# Altium project PCB_3U_CLK_Dist.PrjPcb
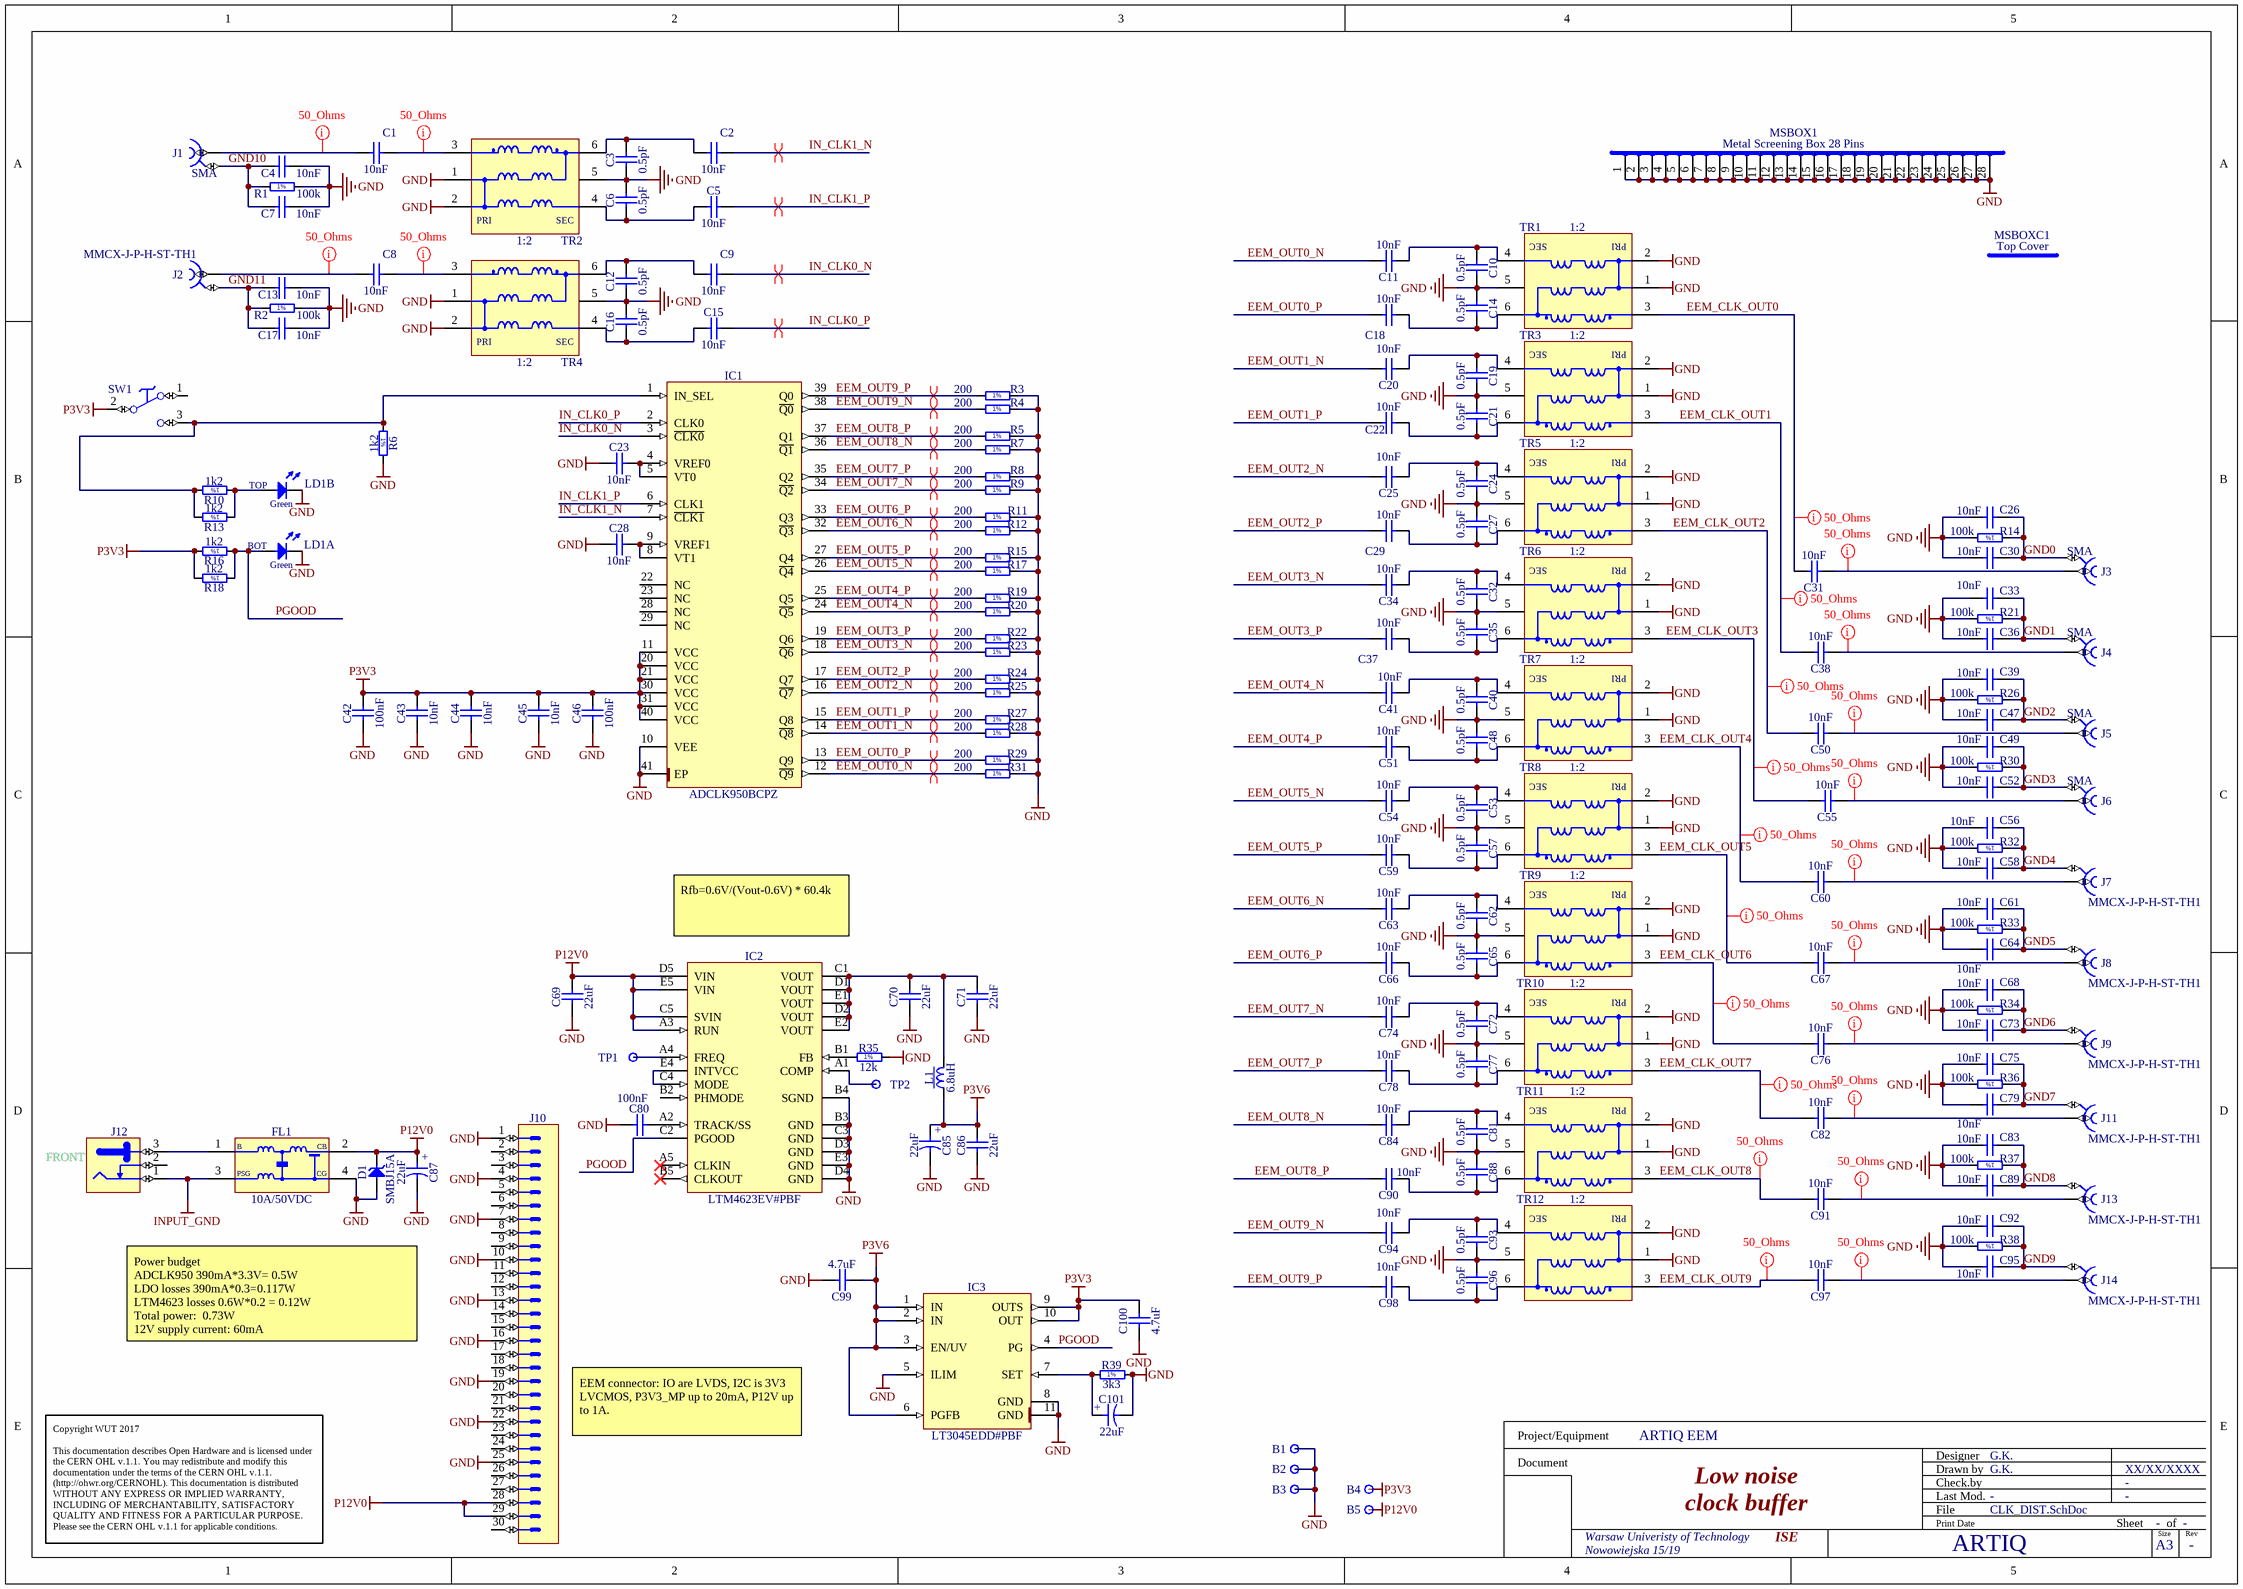
[diagram p0: CLK_DIST.SchDoc]
1 sheet, 183 parts. Net scope: global (net labels, ports and power ports of the same name join across sheets).
Board file: PCB_3U_CLK_DIST.PCBDOC

## Sheet CLK_DIST.SchDoc: Low noise
size 420 x 297 mm; Author: G.K.; CompanyName: WUT; DrawnBy: G.K.; Organization: CERN; Address1: Warsaw Univeristy of Technology; Address2: Nowowiejska 15/19; Revision: -; SheetNumber: -; SheetTotal: -; EDA_Number: ARTIQ; Projet: ARTIQ EEM; ModifiedBy: -; CreateDate: XX/XX/XXXX; CheckedDate: -; Title2: clock buffer; DivGrp: ISE; Designer: G.K.; ModifiedDate: -; ProjectName: ARTIQ EEM

### Parts
B1  Plated Hole  [c130h60]  (value not drawn)
B2  Plated Hole  [c130h60]  (value not drawn)
B3  Plated Hole  [c130h60]  (value not drawn)
B4  Plated Hole  [c130h60]  (value not drawn)
B5  Plated Hole  [c130h60]  (value not drawn)
C1  10nF  [CAPC1608X87N]
C2  10nF  [CAPC1608X87N]
C3  0.5pF  [CAPC1005X50N]
C4  10nF  [CAPC1608X87N]
C5  10nF  [CAPC1608X87N]
C6  0.5pF  [CAPC1005X50N]
C7  10nF  [CAPC1608X87N]
C8  10nF  [CAPC1608X87N]
C9  10nF  [CAPC1608X87N]
C10  0.5pF  [CAPC1005X50N]
C11  10nF  [CAPC1608X87N]
C12  0.5pF  [CAPC1005X50N]
C13  10nF  [CAPC1608X87N]
C14  0.5pF  [CAPC1005X50N]
C15  10nF  [CAPC1608X87N]
C16  0.5pF  [CAPC1005X50N]
C17  10nF  [CAPC1608X87N]
C18  10nF  [CAPC1608X87N]
C19  0.5pF  [CAPC1005X50N]
C20  10nF  [CAPC1608X87N]
C21  0.5pF  [CAPC1005X50N]
C22  10nF  [CAPC1608X87N]
C23  10nF  [CAPC1608X87N]
C24  0.5pF  [CAPC1005X50N]
C25  10nF  [CAPC1608X87N]
C26  10nF  [CAPC1608X87N]
C27  0.5pF  [CAPC1005X50N]
C28  10nF  [CAPC1608X87N]
C29  10nF  [CAPC1608X87N]
C30  10nF  [CAPC1608X87N]
C31  10nF  [CAPC1608X87N]
C32  0.5pF  [CAPC1005X50N]
C33  10nF  [CAPC1608X87N]
C34  10nF  [CAPC1608X87N]
C35  0.5pF  [CAPC1005X50N]
C36  10nF  [CAPC1608X87N]
C37  10nF  [CAPC1608X87N]
C38  10nF  [CAPC1608X87N]
C39  10nF  [CAPC1608X87N]
C40  0.5pF  [CAPC1005X50N]
C41  10nF  [CAPC1608X87N]
C42  100nF  [CAPC1005X55N]
C43  10nF  [CAPC1608X87N]
C44  10nF  [CAPC1608X87N]
C45  10nF  [CAPC1608X87N]
C46  100nF  [CAPC1005X55N]
C47  10nF  [CAPC1608X87N]
C48  0.5pF  [CAPC1005X50N]
C49  10nF  [CAPC1608X87N]
C50  10nF  [CAPC1608X87N]
C51  10nF  [CAPC1608X87N]
C52  10nF  [CAPC1608X87N]
C53  0.5pF  [CAPC1005X50N]
C54  10nF  [CAPC1608X87N]
C55  10nF  [CAPC1608X87N]
C56  10nF  [CAPC1608X87N]
C57  0.5pF  [CAPC1005X50N]
C58  10nF  [CAPC1608X87N]
C59  10nF  [CAPC1608X87N]
C60  10nF  [CAPC1608X87N]
C61  10nF  [CAPC1608X87N]
C62  0.5pF  [CAPC1005X50N]
C63  10nF  [CAPC1608X87N]
C64  10nF  [CAPC1608X87N]
C65  0.5pF  [CAPC1005X50N]
C66  10nF  [CAPC1608X87N]
C67  10nF  [CAPC1608X87N]
C68  10nF  [CAPC1608X87N]
C69  22uF  [CAPC2012X135N]
C70  22uF  [CAPC2012X135N]
C71  22uF  [CAPC2012X135N]
C72  0.5pF  [CAPC1005X50N]
C73  10nF  [CAPC1608X87N]
C74  10nF  [CAPC1608X87N]
C75  10nF  [CAPC1608X87N]
C76  10nF  [CAPC1608X87N]
C77  0.5pF  [CAPC1005X50N]
C78  10nF  [CAPC1608X87N]
C79  10nF  [CAPC1608X87N]
C80  100nF  [CAPC1005X55N]
C81  0.5pF  [CAPC1005X50N]
C82  10nF  [CAPC1608X87N]
C83  10nF  [CAPC1608X87N]
C84  10nF  [CAPC1608X87N]
C85  22uF  [CAPMP3216X180N]
C86  22uF  [CAPC2012X135N]
C87  22uF  [CAPAE530X540N]
C88  0.5pF  [CAPC1005X50N]
C89  10nF  [CAPC1608X87N]
C90  10nF  [CAPC1608X87N]
C91  10nF  [CAPC1608X87N]
C92  10nF  [CAPC1608X87N]
C93  0.5pF  [CAPC1005X50N]
C94  10nF  [CAPC1608X87N]
C95  10nF  [CAPC1608X87N]
C96  0.5pF  [CAPC1005X50N]
C97  10nF  [CAPC1608X87N]
C98  10nF  [CAPC1608X87N]
C99  4.7uF  [CAPC1608X90N]
C100  4.7uF  [CAPC1608X90N]
C101  22uF  [CAPMP3216X180N]
D1  SMBJ15A  [DIOM5336X265N]
FL1  10A/50VDC  [FIL_MURATA_BNX02]
IC1  ADCLK950BCPZ  [QFN50P600X600X100-41N-S305]
IC2  LTM4623EV#PBF  [LGA25C127P5X5_625X625X192]
IC3  LT3045EDD#PBF  [SON50P300X300X80-11N-R175X248]
J1  SMA  [RF249BT0050GHDW]
J2  MMCX-J-P-H-ST-TH1  [SAMTEC_MMCX-J-P-H-ST-TH1]
J3  SMA  [RF249BT0050GHDW]
J4  SMA  [RF249BT0050GHDW]
J5  SMA  [RF249BT0050GHDW]
J6  SMA  [RF249BT0050GHDW]
J7  MMCX-J-P-H-ST-TH1  [SAMTEC_MMCX-J-P-H-ST-TH1]
J8  MMCX-J-P-H-ST-TH1  [SAMTEC_MMCX-J-P-H-ST-TH1]
J9  MMCX-J-P-H-ST-TH1  [SAMTEC_MMCX-J-P-H-ST-TH1]
J10  (no value)  [3M_N2530-6002RB]
J11  MMCX-J-P-H-ST-TH1  [SAMTEC_MMCX-J-P-H-ST-TH1]
J12  Jack  [SWITCHCRAFT_L712RA]  (value not drawn)
J13  MMCX-J-P-H-ST-TH1  [SAMTEC_MMCX-J-P-H-ST-TH1]
J14  MMCX-J-P-H-ST-TH1  [SAMTEC_MMCX-J-P-H-ST-TH1]
L1  6.8uH  [IND_COILCRAFT_XAL4030]
LD1  Green/Green  [LED_DIALIGHT_571-0122F]  (value not drawn)  (parts A,B of 2)
MSBOX1  Metal Screening Box 28 Pins  [MSBOX_LAIRD_BMI-S-207-F]
MSBOXC1  Top Cover  [MSBOX_LAIRD_BMI-S-207-C]
R1  100k  [RESC1005X40N]
R2  100k  [RESC1005X40N]
R3  200  [RESC1005X40N]
R4  200  [RESC1005X40N]
R5  200  [RESC1005X40N]
R6  1k2  [RESC1608X55N]
R7  200  [RESC1005X40N]
R8  200  [RESC1005X40N]
R9  200  [RESC1005X40N]
R10  1k2  [RESC1608X55N]
R11  200  [RESC1005X40N]
R12  200  [RESC1005X40N]
R13  1k2  [RESC1608X55N]
R14  100k  [RESC1005X40N]
R15  200  [RESC1005X40N]
R16  1k2  [RESC1608X55N]
R17  200  [RESC1005X40N]
R18  1k2  [RESC1608X55N]
R19  200  [RESC1005X40N]
R20  200  [RESC1005X40N]
R21  100k  [RESC1005X40N]
R22  200  [RESC1005X40N]
R23  200  [RESC1005X40N]
R24  200  [RESC1005X40N]
R25  200  [RESC1005X40N]
R26  100k  [RESC1005X40N]
R27  200  [RESC1005X40N]
R28  200  [RESC1005X40N]
R29  200  [RESC1005X40N]
R30  100k  [RESC1005X40N]
R31  200  [RESC1005X40N]
R32  100k  [RESC1005X40N]
R33  100k  [RESC1005X40N]
R34  100k  [RESC1005X40N]
R35  12k  [RESC1608X55N]
R36  100k  [RESC1005X40N]
R37  100k  [RESC1005X40N]
R38  100k  [RESC1005X40N]
R39  3k3  [RESC1608X55N]
SW1  Switch  [SW_TYCO_1-1437575-4]  (value not drawn)
TP1  Test Point  [TPS127]  (value not drawn)
TP2  Test Point  [TPS127]  (value not drawn)
TR1  1:2  [XFMR_MINI-CIRCUITS_DB1627]
TR2  1:2  [XFMR_MINI-CIRCUITS_DB1627]
TR3  1:2  [XFMR_MINI-CIRCUITS_DB1627]
TR4  1:2  [XFMR_MINI-CIRCUITS_DB1627]
TR5  1:2  [XFMR_MINI-CIRCUITS_DB1627]
TR6  1:2  [XFMR_MINI-CIRCUITS_DB1627]
TR7  1:2  [XFMR_MINI-CIRCUITS_DB1627]
TR8  1:2  [XFMR_MINI-CIRCUITS_DB1627]
TR9  1:2  [XFMR_MINI-CIRCUITS_DB1627]
TR10  1:2  [XFMR_MINI-CIRCUITS_DB1627]
TR11  1:2  [XFMR_MINI-CIRCUITS_DB1627]
TR12  1:2  [XFMR_MINI-CIRCUITS_DB1627]

### Nets
GND: B1.1 B2.1 B3.1 C3.1 C4.2 C6.2 C7.2 C10.2 C12.1 C13.2 C14.1 C16.2 C17.2 C19.2 C21.1 C23.1 C24.2 C26.2 C27.1 C28.1 C30.1 C32.2 C33.2 C35.1 C36.1 C39.2 C40.2 C42.1 C43.1 C44.1 C45.1 C46.1 C47.1 C48.1 C49.2 C52.1 C53.2 C56.2 C57.1 C58.1 C61.2 C62.2 C64.1 C65.1 C68.2 C69.1 C70.1 C71.1 C72.2 C73.1 C75.2 C77.1 C79.1 C80.1 C81.2 C83.2 C85.2 C86.1 C87.2 C88.1 C89.1 C92.2 C93.2 C95.1 C96.1 C99.2 C100.1 C101.2 D1.2(A) FL1.4(CG) IC1.10(VEE) IC1.41(EP) IC2.B3(GND) IC2.B4(SGND) IC2.C3(GND) IC2.D3(GND) IC2.D4(GND) IC2.E3(GND) IC3.5(ILIM) IC3.8(GND) IC3.11(GND) J10.1 J10.4 J10.7 J10.10 J10.13 J10.16 J10.19 J10.22 J10.25 LD1.1(C) LD1.3(C) MSBOX1.1 MSBOX1.2 MSBOX1.3 MSBOX1.4 MSBOX1.5 MSBOX1.6 MSBOX1.7 MSBOX1.8 MSBOX1.9 MSBOX1.10 MSBOX1.11 MSBOX1.12 MSBOX1.13 MSBOX1.14 MSBOX1.15 MSBOX1.16 MSBOX1.17 MSBOX1.18 MSBOX1.19 MSBOX1.20 MSBOX1.21 MSBOX1.22 MSBOX1.23 MSBOX1.24 MSBOX1.25 MSBOX1.26 MSBOX1.27 MSBOX1.28 R1.1 R2.1 R3.2 R4.2 R5.2 R6.2 R7.2 R8.2 R9.2 R11.2 R12.2 R14.1 R15.2 R17.2 R19.2 R20.2 R21.1 R22.2 R23.2 R24.2 R25.2 R26.1 R27.2 R28.2 R29.2 R30.1 R31.2 R32.1 R33.1 R34.1 R35.2 R36.1 R37.1 R38.1 R39.2 TR1.1(P1) TR1.2(P1) TR1.5(NC) TR2.1(P1) TR2.2(P1) TR2.5(NC) TR3.1(P1) TR3.2(P1) TR3.5(NC) TR4.1(P1) TR4.2(P1) TR4.5(NC) TR5.1(P1) TR5.2(P1) TR5.5(NC) TR6.1(P1) TR6.2(P1) TR6.5(NC) TR7.1(P1) TR7.2(P1) TR7.5(NC) TR8.1(P1) TR8.2(P1) TR8.5(NC) TR9.1(P1) TR9.2(P1) TR9.5(NC) TR10.1(P1) TR10.2(P1) TR10.5(NC) TR11.1(P1) TR11.2(P1) TR11.5(NC) TR12.1(P1) TR12.2(P1) TR12.5(NC)
INPUT_GND: FL1.3(PSG) J12.1
P3V3: B4.1 C42.2 C43.2 C44.2 C45.2 C46.2 C100.2 IC1.11(VCC) IC1.20(VCC) IC1.21(VCC) IC1.30(VCC) IC1.31(VCC) IC1.40(VCC) IC3.9(OUTS) IC3.10(OUT) R16.2 R18.2 SW1.2(C)
P3V6: C85.1 C86.2 C99.1 IC3.1(IN) IC3.2(IN) IC3.3(EN/UV) IC3.6(PGFB) L1.1
P12V0: B5.1 C69.2 C87.1 D1.1(C) FL1.2(CB) IC2.A3(RUN) IC2.C5(SVIN) IC2.D5(VIN) IC2.E5(VIN) J10.28 J10.29
EEM_CLK_OUT0: C31.2 TR1.3(P1)
EEM_CLK_OUT1: C38.2 TR3.3(P1)
EEM_CLK_OUT2: C50.2 TR5.3(P1)
EEM_CLK_OUT3: C55.2 TR6.3(P1)
EEM_CLK_OUT4: C60.2 TR7.3(P1)
EEM_CLK_OUT5: C67.2 TR8.3(P1)
EEM_CLK_OUT6: C76.2 TR9.3(P1)
EEM_CLK_OUT7: C82.2 TR10.3(P1)
EEM_CLK_OUT8: C91.2 TR11.3(P1)
EEM_CLK_OUT9: C97.2 TR12.3(P1)
EEM_OUT0_N: C11.2 IC1.12(~{Q9}) R31.1
EEM_OUT0_P: C18.2 IC1.13(Q9) R29.1
EEM_OUT1_N: C20.2 IC1.14(~{Q8}) R28.1
EEM_OUT1_P: C22.2 IC1.15(Q8) R27.1
EEM_OUT2_N: C25.2 IC1.16(~{Q7}) R25.1
EEM_OUT2_P: C29.2 IC1.17(Q7) R24.1
EEM_OUT3_N: C34.2 IC1.18(~{Q6}) R23.1
EEM_OUT3_P: C37.2 IC1.19(Q6) R22.1
EEM_OUT4_N: C41.2 IC1.24(~{Q5}) R20.1
EEM_OUT4_P: C51.2 IC1.25(Q5) R19.1
EEM_OUT5_N: C54.2 IC1.26(~{Q4}) R17.1
EEM_OUT5_P: C59.2 IC1.27(Q4) R15.1
EEM_OUT6_N: C63.2 IC1.32(~{Q3}) R12.1
EEM_OUT6_P: C66.2 IC1.33(Q3) R11.1
EEM_OUT7_N: C74.2 IC1.34(~{Q2}) R9.1
EEM_OUT7_P: C78.2 IC1.35(Q2) R8.1
EEM_OUT8_N: C84.2 IC1.36(~{Q1}) R7.1
EEM_OUT8_P: C90.2 IC1.37(Q1) R5.1
EEM_OUT9_N: C94.2 IC1.38(~{Q0}) R4.1
EEM_OUT9_P: C98.2 IC1.39(Q0) R3.1
GND0: C26.1 C30.2 J3.2 R14.2
GND1: C33.1 C36.2 J4.2 R21.2
GND2: C39.1 C47.2 J5.2 R26.2
GND3: C49.1 C52.2 J6.2 R30.2
GND4: C56.1 C58.2 J7.2 R32.2
GND5: C61.1 C64.2 J8.2 R33.2
GND6: C68.1 C73.2 J9.2 R34.2
GND7: C75.1 C79.2 J11.2 R36.2
GND8: C83.1 C89.2 J13.2 R37.2
GND9: C92.1 C95.2 J14.2 R38.2
GND10: C4.1 C7.1 J1.2 R1.2
GND11: C13.1 C17.1 J2.2 R2.2
IN_CLK0_N: C9.2 IC1.3(~{CLK0})
IN_CLK0_P: C15.2 IC1.2(CLK0)
IN_CLK1_N: C2.2 IC1.7(~{CLK1})
IN_CLK1_P: C5.2 IC1.6(CLK1)
PGOOD: IC2.C2(PGOOD) IC3.4(PG) LD1.2(A) R16.1 R18.1
NetC1_1: C1.1 J1.1
NetC1_2: C1.2 TR2.3(P1)
NetC2_1: C2.1 C3.2 TR2.6(S1)
NetC5_1: C5.1 C6.1 TR2.4(S1)
NetC8_1: C8.1 J2.1
NetC8_2: C8.2 TR4.3(P1)
NetC9_1: C9.1 C12.2 TR4.6(S1)
NetC10_1: C10.1 C11.1 TR1.4(S1)
NetC14_2: C14.2 C18.1 TR1.6(S1)
NetC15_1: C15.1 C16.1 TR4.4(S1)
NetC19_1: C19.1 C20.1 TR3.4(S1)
NetC21_2: C21.2 C22.1 TR3.6(S1)
NetC23_2: C23.2 IC1.4(VREF0) IC1.5(VT0)
NetC24_1: C24.1 C25.1 TR5.4(S1)
NetC27_2: C27.2 C29.1 TR5.6(S1)
NetC28_2: C28.2 IC1.8(VT1) IC1.9(VREF1)
NetC31_1: C31.1 J3.1
NetC32_1: C32.1 C34.1 TR6.4(S1)
NetC35_2: C35.2 C37.1 TR6.6(S1)
NetC38_1: C38.1 J4.1
NetC40_1: C40.1 C41.1 TR7.4(S1)
NetC48_2: C48.2 C51.1 TR7.6(S1)
NetC50_1: C50.1 J5.1
NetC53_1: C53.1 C54.1 TR8.4(S1)
NetC55_1: C55.1 J6.1
NetC57_2: C57.2 C59.1 TR8.6(S1)
NetC60_1: C60.1 J7.1
NetC62_1: C62.1 C63.1 TR9.4(S1)
NetC65_2: C65.2 C66.1 TR9.6(S1)
NetC67_1: C67.1 J8.1
NetC70_2: C70.2 C71.2 IC2.C1(VOUT) IC2.D1(VOUT) IC2.D2(VOUT) IC2.E1(VOUT) IC2.E2(VOUT) L1.2
NetC72_1: C72.1 C74.1 TR10.4(S1)
NetC76_1: C76.1 J9.1
NetC77_2: C77.2 C78.1 TR10.6(S1)
NetC80_2: C80.2 IC2.A2(TRACK/SS)
NetC81_1: C81.1 C84.1 TR11.4(S1)
NetC82_1: C82.1 J11.1
NetC88_2: C88.2 C90.1 TR11.6(S1)
NetC91_1: C91.1 J13.1
NetC93_1: C93.1 C94.1 TR12.4(S1)
NetC96_2: C96.2 C98.1 TR12.6(S1)
NetC97_1: C97.1 J14.1
NetC101_1: C101.1 IC3.7(SET) R39.1
NetFL1_1: FL1.1(B) J12.3
NetIC1_1: IC1.1(IN_SEL) R6.1 R10.2 R13.2 SW1.3(NO)
NetIC2_A1: IC2.A1(COMP) TP2.1
NetIC2_A4: IC2.A4(FREQ) TP1.1
NetIC2_B1: IC2.B1(FB) R35.1
NetIC2_C4: IC2.C4(MODE) IC2.E4(INTVCC)
NetLD1_4: LD1.4(A) R10.1 R13.1

Not connected (* = marked no-connect by the designer): IC1 22(NC) 23(NC) 28(NC) 29(NC); IC2 A5(CLKIN)* B2(PHMODE) B5(CLKOUT)*; J10 2 3 5 6 8 9 11 12 14 15 17 18 20 21 23 24 26 27 30; J12 2; SW1 1(NC)

### Layout directives
differential pair: EEM_OUT0_N, EEM_OUT0_P, EEM_OUT1_N, EEM_OUT1_P, EEM_OUT2_N, EEM_OUT2_P, EEM_OUT3_N, EEM_OUT3_P, EEM_OUT4_N, EEM_OUT4_P, EEM_OUT5_N, EEM_OUT5_P, EEM_OUT6_N, EEM_OUT6_P, EEM_OUT7_N, EEM_OUT7_P, EEM_OUT8_N, EEM_OUT8_P, EEM_OUT9_N, EEM_OUT9_P, IN_CLK0_N, IN_CLK0_P, IN_CLK1_N, IN_CLK1_P
net class 50_Ohms: EEM_CLK_OUT0, EEM_CLK_OUT1, EEM_CLK_OUT2, EEM_CLK_OUT3, EEM_CLK_OUT4, EEM_CLK_OUT5, EEM_CLK_OUT6, EEM_CLK_OUT7, EEM_CLK_OUT8, EEM_CLK_OUT9, NetC1_1, NetC1_2, NetC8_1, NetC8_2, NetC31_1, NetC38_1, NetC50_1, NetC55_1, NetC60_1, NetC67_1, NetC76_1, NetC82_1, NetC91_1, NetC97_1

### Notes on the sheet
- (near IC2) Rfb=0.6V/(Vout-0.6V) * 60.4k
- FRONT
- Power budget
  ADCLK950	390mA*3.3V= 0.5W
  LDO losses	390mA*0.3=0.117W
  LTM4623 losses	0.6W*0.2 = 0.12W
  Total power: 	0.73W
  12V supply current:	60mA
- EEM connector: IO are LVDS, I2C is 3V3 LVCMOS, P3V3_MP up to 20mA, P12V up to 1A.
- Copyright WUT 2017
  This documentation describes Open Hardware and is licensed under the CERN OHL v.1.1. You may redistribute and modify this documentation under the terms of the CERN OHL v.1.1. (http://ohwr.org/CERNOHL). This documentation is distributed WITHOUT ANY EXPRESS OR IMPLIED WARRANTY, INCLUDING OF MERCHANTABILITY, SATISFACTORY QUALITY AND FITNESS FOR A PARTICULAR PURPOSE. Please see the CERN OHL v.1.1 for applicable conditions.
- Project/Equipment
- Document
- Designer
- Drawn by
- Check.by
- File
- Last Mod.
- Print Date
- Sheet
- Size
- A3
- of
- Rev
- (in symbol CAE530-540_22UF_16V_20%) +
- (in symbol CTE3216-18_22UF_6.3V_10%_LESR0900) +
- (in symbol LED_DIALIGHT_571-0122F, part A) BOT; Green
- (in symbol LED_DIALIGHT_571-0122F, part B) TOP; Green
- (in symbol R0402_100K_1%_0.0625W_100PPM) 1%
- (in symbol R0402_200R_1%_0.0625W_100PPM) 1%
- (in symbol R0603_1K2_1%_0.1W_100PPM) 1%
- (in symbol R0603_3K3_1%_0.1W_100PPM) 1%
- (in symbol R0603_12K_1%_0.1W_100PPM) 1%
- (in symbol XFMR_MINI-CIRCUITS_TCM2-43X+) SEC; PRI

### Library data of the parts
B1-B5 = PLATED_HOLE0.6_PAD1.3: Single Terminal Socket; Part Description: Plated Through Hole: Hole Dia.=0.6mm Pad Dia.=1.3mm; Mounted: No; Part Number: PLATED_HOLE0.6_PAD1.3; Component Kind: Standard (No BOM); Component Type: Standard (No BOM); Pin Count: 1; Family: Plated Hole; Socket: No; SMD: No; Sense: No; Status: None; ComponentHeight: 0mm; HelpURL: Undefined; Author: CERN DEM MR; CreateDate: 02.03.2016; LatestRevisionDate: 02.03.2016; PackageDescription: Plated Through Hole: Hole Dia.=0.6mm Pad Dia.=1.3mm
C1 C2 C4 C5 C7-C9 C11 C13 C15 C17 C18 C20 C22 C23 C25 C26 C28-C31 C33 C34 C36-C39 C41 C43-C45 C47 C49-C52 C54-C56 C58-C61 C63 C64 C66-C68 C73-C76 C78 C79 C82-C84 C89-C92 C94 C95 C97 C98 = CC0603_10NF_50V_5%_C0G: Non-polarised capacitor; Part Description: SMD Multilayer Chip Ceramic Capacitor; Manufacturer: GENERIC; Manufacturer1 Part Number: C1608C0G1H103J080AA; Voltage: 50V; TC: C0G/NP0; Tolerance: ±5%; Part Number: CC0603_10NF_50V_5%_C0G; Component Kind: Standard; Component Type: Standard; Pin Count: 2; Value: 10nF; Status: Preferred; Manufacturer Part Number: CC0603_10NF_50V_5%_C0G; Case: 0603; Mounted: Yes; Socket: No; SMD: Yes; Sense: No; Manufacturer1 Example: TDK; Manufacturer1 ComponentHeight: 0.9mm; HelpURL: \\cern.ch\dfs\Applications\Altium\Datasheets\CC0603_C0G_TDK_C.pdf; Author: CERN DEM JLC; CreateDate: 10.12.2014; LatestRevisionDate: 10.12.2014
C3 C6 C10 C12 C14 C16 C19 C21 C24 C27 C32 C35 C40 C48 C53 C57 C62 C65 C72 C77 C81 C88 C93 C96 = CC0402_0.5PF_25V_0.05PF_AVX_04023J0R5ABSTR: Non-polarised capacitor; Part Description: Thin-Film Chip Capacitors for RF Signal and Power Applications, Accu-P Series; Manufacturer: AVX; Voltage: 25V; Tolerance: ±0.05pF; Part Number: CC0402_0.5PF_25V_0.05PF_AVX_04023J0R5ABSTR; Component Kind: Standard; Component Type: Standard; Pin Count: 2; Value: 0.5pF; Status: None; Manufacturer Part Number: 04023J0R5ABSTR; Case: 0402; Mounted: Yes; Socket: No; SMD: Yes; Sense: No; ComponentHeight: 0.5mm; HelpURL: \\cern.ch\dfs\Applications\Altium\Datasheets\CC0402_AVX_ACCU-P.pdf; Author: CERN DEM JLC; CreateDate: 2017-02-22; LatestRevisionDate: 2017-02-22
C42 C46 C80 = CC0402_100NF_16V_10%_X5R: Non-polarised capacitor; Part Description: SMD Multilayer Chip Ceramic Capacitor; Manufacturer: GENERIC; Manufacturer1 Part Number: GRM155R61C104KA88D; Voltage: 16V; TC: X5R; Tolerance: ±10%; Part Number: CC0402_100NF_16V_10%_X5R; Component Kind: Standard; Component Type: Standard; Pin Count: 2; Value: 100nF; Status: None; Manufacturer Part Number: CC0402_100NF_16V_10%_X5R; Case: 0402; Mounted: Yes; Socket: No; SMD: Yes; Sense: No; Manufacturer1 Example: MURATA; Manufacturer1 ComponentHeight: 0.55mm; HelpURL: \\cern.ch\dfs\Applications\Altium\Datasheets\CC0402_X5R_MURATA_GRM.pdf; Author: CERN DEM JLC; CreateDate: 10.12.2013; LatestRevisionDate: 10.12.2013
C69-C71 C86 = CC0805_22UF_16V_10%_X5R: Non-polarised capacitor; Part Description: SMD Multilayer Chip Ceramic Capacitor; Manufacturer: GENERIC; Manufacturer1 Part Number: C2012X5R1C226KT; Voltage: 16V; TC: X5R; Tolerance: ±10%; Part Number: CC0805_22UF_16V_10%_X5R; Component Kind: Standard; Component Type: Standard; Pin Count: 2; Value: 22uF; Status: Preferred; Manufacturer Part Number: CC0805_22UF_16V_10%_X5R; Case: 0805; Mounted: Yes; Socket: No; SMD: Yes; Sense: No; Manufacturer1 Example: TDK; Manufacturer1 ComponentHeight: 1.35mm; HelpURL: \\cern.ch\dfs\Applications\Altium\Datasheets\CC0805_X5R_TDK_C.pdf; Author: CERN DEM JLC; CreateDate: 25.10.2012; LatestRevisionDate: 25.10.2012
C85 C101 = CTE3216-18_22UF_6.3V_10%_LESR0900: Polarised capacitor; Part Description: Low ESR 0R9 Solid Tantalum Chip Capacitor; Manufacturer: GENERIC; Manufacturer1 Part Number: TPSA226K006R0900; Voltage: 6.3V; Tolerance: ±10%; Part Number: CTE3216-18_22UF_6.3V_10%_LESR0900; Component Kind: Standard; Component Type: Standard; Pin Count: 2; Value: 22uF; Status: Preferred; Manufacturer Part Number: CTE3216-18_22UF_6.3V_10%_LESR0900; Case: A; Mounted: Yes; Socket: No; SMD: Yes; Sense: No; Manufacturer1 Example: AVX; Manufacturer1 ComponentHeight: 1.8mm; HelpURL: \\cern.ch\dfs\Applications\Altium\Datasheets\CTE-LESR_AVX_TPS.pdf; Author: CERN DEM JLC; CreateDate: 05.05.2008; LatestRevisionDate: 20.01.2009
C87 = CAE530-540_22UF_16V_20%: Polarised capacitor; Part Description: Aluminum Electrolytic SMT Capacitor; Manufacturer: PANASONIC; Manufacturer Part Number: EEEFK1C220AR; Voltage: 16V; Tolerance: ±20%; Part Number: CAE530-540_22UF_16V_20%; Component Kind: Standard; Component Type: Standard; Pin Count: 2; Value: 22uF; Status: Not Recommended; Case: B; Mounted: Yes; Socket: No; SMD: Yes; Sense: No; ComponentHeight: 5.8mm; HelpURL: \\cern.ch\dfs\Applications\Altium\Datasheets\CAE_PANASONIC_FK.pdf; Author: CERN DEM JLC; CreateDate: 03.12.2007; LatestRevisionDate: 05.11.2014
C99 C100 = CC0603_4.7UF_25V_10%_X5R: Non-polarised capacitor; Part Description: SMD Multilayer Chip Ceramic Capacitor; Manufacturer: GENERIC; Manufacturer1 Part Number: GRM188R61E475KE11D; Voltage: 25V; TC: X5R; Tolerance: ±10%; Part Number: CC0603_4.7UF_25V_10%_X5R; Component Kind: Standard; Component Type: Standard; Pin Count: 2; Value: 4.7uF; Status: None; Manufacturer Part Number: CC0603_4.7UF_25V_10%_X5R; Case: 0603; Mounted: Yes; Socket: No; SMD: Yes; Sense: No; Manufacturer1 Example: MURATA; Manufacturer1 ComponentHeight: 0.95mm; HelpURL: \\cern.ch\dfs\Applications\Altium\Datasheets\CC0603_MURATA_GRM188R61E475KE11D.pdf; Author: CERN DEM JLC; CreateDate: 10.11.2014; LatestRevisionDate: 10.11.2014
D1 = SMBJ15A: Zener Diode; Part Description: Uni-Directional Transient Voltage Suppressor Diode; Manufacturer: FAIRCHILD SEMICONDUCTOR; Voltage: 15V; Power: 600W; PressFit: No; Bonding: No; Part Number: SMBJ15A; Component Kind: Standard; Component Type: Standard; Device: SMBJ15A; PackageDescription: DO-214-AA/SMB Diode, Molded Body; 5.34mm L X 3.625mm W X 2.65mm H, IPC Medium Density; Manufacturer Part Number: SMBJ15A; Pin Count: 2; Case: DO-214AA; Mounted: Yes; Socket: No; SMD: Yes; Sense: No; ComponentHeight: 2.65mm; HelpURL: \\cern.ch\dfs\Applications\Altium\Datasheets\SMBJ.pdf; Author: CERN DEM JLC; CreateDate: 08.12.2008; LatestRevisionDate: 19.12.2011
FL1 = FIL_MURATA_BNX022-01L: Block Type EMIFIL (LC Combined); Part Description: Block Type EMIFIL (LC Combined) SMD Type, BNX02* Series; Manufacturer: MURATA; Resistance: 0.5R; Part Number: FIL_MURATA_BNX022-01L; Component Kind: Standard; Component Type: Standard; Pin Count: 2; Value: 10A/50VDC; Status: None; Manufacturer Part Number: BNX022-01L; Mounted: Yes; Socket: No; SMD: Yes; Sense: No; ComponentHeight: 3.3mm; HelpURL: \\cern.ch\dfs\Applications\Altium\Datasheets\FIL_MURATA_BNX022-01L.pdf; Author: CERN DEM JLC; CreateDate: 10.10.2012; LatestRevisionDate: 10.10.2012
IC1 = ADCLK950BCPZ: Two Selectable Inputs, 10 LVPECL Outputs, SiGe Clock Fanout Buffer; Manufacturer: ANALOG DEVICES; PressFit: No; Bonding: No; Part Number: ADCLK950BCPZ; Component Kind: Standard; Component Type: Standard; Device: ADCLK950BCPZ; PackageDescription: QFN, 0.50mm Pitch, Square; 40 Pin, 6.00mm L X 6.00mm W X 1.00mm H Body (W/Thermal Tab 3.05mm X 3.05mm), IPC Medium Density; Part Description: Two Selectable Inputs, 10 LVPECL Outputs, SiGe Clock Fanout Buffer; Manufacturer Part Number: ADCLK950BCPZ; Pin Count: 41; Case: QFN40; Mounted: Yes; Socket: No; SMD: Yes; Sense: No; ComponentHeight: 1mm; Author: CERN DEM BC; HelpURL: \\cern.ch\dfs\Applications\Altium\Datasheets\ADCLK950BCPZ.pdf; CreateDate: 15.08.2016; LatestRevisionDate: 15.08.2016
IC2 = LTM4623EV#PBF: 4V-20V to 0.6V-5.5V, Iout 3A Step-Down DC/DC uModule Regulator; Manufacturer: LINEAR TECHNOLOGY; PressFit: No; Bonding: No; Part Number: LTM4623EV#PBF; Component Kind: Standard; Component Type: Standard; Device: LTM4623EV#PBF; PackageDescription: LGA, 1.27mm Pitch, Square; 25 Pin, 5 Columns X 5 Rows, 6.25mm X 6.25mm X 1.92mm H; Part Description: 4V-20V to 0.6V-5.5V, Iout 3A Step-Down DC/DC uModule Regulator; Manufacturer Part Number: LTM4623EV#PBF; Pin Count: 25; Case: LGA25; Mounted: Yes; Socket: No; SMD: Yes; Sense: No; ComponentHeight: 1.92mm; HelpURL: \\cern.ch\dfs\Applications\Altium\Datasheets\LTM4623EV#PBF.pdf; Author: CERN DEM JMW; CreateDate: 23.09.2015; LatestRevisionDate: 23.09.2015
IC3 = LT3045EDD#PBF: 20V, 500mA, Ultralow Noise, Ultrahigh PSRR Linear Regulator; Manufacturer: LINEAR TECHNOLOGY; PressFit: No; Bonding: No; Part Number: LT3045EDD#PBF; Component Kind: Standard; Component Type: Standard; Device: LT3045EDD#PBF; PackageDescription: SON, 0.50mm Pitch, 10-pin, 3.00mm W  X 3.00mm L X 0.80mm Height, (w/thermal tab 1.75 X 2.48 mm), IPC Medium Density; Part Description: 20V, 500mA, Ultralow Noise, Ultrahigh PSRR Linear Regulator; Manufacturer Part Number: LT3045EDD#PBF; Pin Count: 11; Case: SON10; Mounted: Yes; Socket: No; SMD: Yes; Sense: No; ComponentHeight: 0.8mm; HelpURL: \\cern.ch\dfs\Applications\Altium\Datasheets\LT3045EDD#PBF.pdf; Author: CERN DEM JLC; CreateDate: 07.12.2016; LatestRevisionDate: 07.12.2016
J1 J3-J6 = CON_SMA_RF249BT0050GHDW: 50 Ohm Through Hole SMA Right Angle PCB Jack; Part Number: AdamTech_RF249BT0050GHDW; Manufacturer: AdamTech; PressFit: No; Component Kind: Standard; Component Type: Standard; Pin Count: 5; Family: SMA; Mounted: Yes; Socket: No; SMD: No; Sense: No; Status: None; Part Description: 50 Ohm Through Hole SMA Right Angle PCB Jack; Manufacturer Part Number: RF249BT0050GHDW; ComponentHeight: 10.44mm; HelpURL: \\cern.ch\dfs\Applications\Altium\Datasheets\AMPHENOL_132203.pdf; Author: GK; CreateDate: 06.10.2016; LatestRevisionDate: 06.10.2016
J2 J7-J9 J11 J13 J14 = SAMTEC_MMCX-J-P-H-ST-TH1: Part Description: Straight Through-hole 50 Ohm Micro Mini RF Jack, MMCX Series; Manufacturer: SAMTEC; PressFit: No; Part Number: SAMTEC_MMCX-J-P-H-ST-TH1; Component Kind: Standard; Component Type: Standard; Pin Count: 2; Mounted: Yes; Socket: No; Sense: No; SMD: No; Status: None; Manufacturer Part Number: MMCX-J-P-H-ST-TH1; ComponentHeight: 4.35mm; HelpURL: \\cern.ch\dfs\Applications\Altium\Datasheets\SAMTEC_MMCX-J-P-H-ST-TH1.pdf; Author: CERN DEM JLC; CreateDate: 05.12.2012; LatestRevisionDate: 05.12.2012
J10 = 3M_N2530-6002RB: Connector 30 Male; Part Description: 30 Contacts - Straight .100'' x .100'' Low Profile Four-Wall Header, 2500 Series; Manufacturer: 3M; PressFit: No; Part Number: 3M_N2530-6002RB; Component Kind: Standard; Component Type: Standard; Pin Count: 30; Family: Header 30; Mounted: Yes; Socket: No; SMD: No; Sense: No; Status: None; Manufacturer Part Number: N2530-6002RB; ComponentHeight: 10.03mm; HelpURL: \\cern.ch\dfs\Applications\Altium\Datasheets\3M_N2530-6002RB.pdf; Author: CERN DEM JLC; CreateDate: 11.02.2009; LatestRevisionDate: 11.08.2009
J12 = CON_DC_5A_THT_RA: 24V /3. 5A, 2.1mm Diameter Pin, SMD DC Power Supply Connector With  Break Contact; Part Number: SWITCHCRAFT_712RA; Part Description: 12V/5A, 2.5mm Diameter Pin, THT DC Power Supply Connector With  Break Contact; Manufacturer: SWITCHCRAFT; Manufacturer Part Number: 712RA; PressFit: No; Component Kind: Standard; Component Type: Standard; Footprint: SWITCHCRAFT_712RA; Pin Count: 3; Family: Jack; Mounted: Yes; Socket: No; SMD: No; Sense: No; Status: None; ComponentHeight: 11mm; HelpURL: \\cern.ch\dfs\Applications\Altium\Datasheets\LUMBERG_161314.pdf; Author: GK; CreateDate: 15.02.2011; LatestRevisionDate: 20.07.2011
L1 = IND_6.8UH_20%_COILCRAFT_XAL4030: Inductor With Core; Part Description: SMD Shielded Power Inductor; Manufacturer Part Number: XAL4030-682MEB; Power: 3A; Resistance: 0.0741R; Tolerance: ±20%; Part Number: IND_6.8UH_20%_COILCRAFT_XAL4030; Component Kind: Standard; Component Type: Standard; Pin Count: 2; Value: 6.8uH; Status: None; Manufacturer: COILCRAFT; Mounted: Yes; Socket: No; SMD: Yes; Sense: No; ComponentHeight: 2.1mm; HelpURL: \\cern.ch\dfs\Applications\Altium\Datasheets\IND_COILCRAFT_XAL4030.pdf; Author: CERN DEM MR; CreateDate: 14.03.2016; LatestRevisionDate: 14.03.2016
LD1 = LED_DIALIGHT_571-0122F: LED x2 Green 1C2A-BOT_3C4A-TOP; Part Description: Dual 2mm Green LEDs CBI® Circuit Board Indicator (Without positioning pins); PressFit: No; Bonding: No; Part Number: LED_DIALIGHT_571-0122F; Component Kind: Standard; Component Type: Standard; Color: Green/Green; PackageDescription: 2x 2mm Red LED PCB Edge Mounting (Without positioning pins) DIALIGHT 571 Serie; Manufacturer: DIALIGHT; Manufacturer Part Number: 571-0122F; Pin Count: 4; Mounted: Yes; Socket: No; SMD: No; Sense: No; ComponentHeight: 8.6mm; HelpURL: \\cern.ch\dfs\Applications\Altium\Datasheets\LED_DIALIGHT_571-0122F.pdf; Author: CERN DEM JLC; CreateDate: 09.11.2009; LatestRevisionDate: 17.03.2010
MSBOX1 = MSBOX_LAIRD_BMI-S-207-F: Part Description: Frame of Standard Surface Mount Shield (Two Piece), External Dimensions 44.37 x 44.37mm; Manufacturer: LAIRD; PressFit: No; Part Number: MSBOX_LAIRD_BMI-S-207-F; Component Kind: Standard; Component Type: Standard; Pin Count: 28; PackageDescription: Frame of Standard Surface Mount Shield (Two Piece), External Dimensions 44.37x 44.37mm; Mounted: Yes; Socket: No; SMD: Yes; Sense: No; Status: None; Manufacturer Part Number: BMI-S-207-F; ComponentHeight: 9.75mm; HelpURL: \\cern.ch\dfs\Applications\Altium\Datasheets\MSBOX_LAIRD_BMI-S-207-F.pdf; Author: CERN DEM JLC; CreateDate: 04.07.2017; LatestRevisionDate: 04.07.2017
MSBOXC1 = MSBOX_LAIRD_BMI-S-207-C: Metal Screening Box - Top Cover 0 Pin; Part Description: Cover for Frame of Standard Surface Mount Shield (Two Piece), External Dimensions 44.83 x 44.83mm; Manufacturer: LAIRD; PressFit: No; Part Number: MSBOX_LAIRD_BMI-S-207-C; Component Kind: Standard; Component Type: Standard; Pin Count: 0; PackageDescription: Cover for Frame of Standard Surface Mount Shield (Two Piece), External Dimensions 44.83 x 44.83mm; Mounted: Yes; Socket: No; SMD: Yes; Sense: No; Status: None; Manufacturer Part Number: BMI-S-207-C; ComponentHeight: 2mm; HelpURL: \\cern.ch\dfs\Applications\Altium\Datasheets\MSBOX_LAIRD_BMI-S-207-C.pdf; Author: CERN DEM JLC; CreateDate: 04.07.2017; LatestRevisionDate: 04.07.2017
R1 R2 R14 R21 R26 R30 R32-R34 R36-R38 = R0402_100K_1%_0.0625W_100PPM: Resistor - 1%; Part Description: General Purpose Thick Film Chip Resistor; Manufacturer: GENERIC; Manufacturer1 Part Number: 232270671004L; TC: ±100ppm/°C; Part Number: R0402_100K_1%_0.0625W_100PPM; Component Kind: Standard; Component Type: Standard; Pin Count: 2; Value: 100k; Status: Not recommended; Power: 0.0625W; Tolerance: ±1%; Manufacturer Part Number: R0402_100K_1%_0.0625W_100PPM; Case: 0402; Mounted: Yes; Sense: No; Socket: No; SMD: Yes; Manufacturer1 Example: YAGEO PHYCOMP; Manufacturer1 ComponentHeight: 0.4mm; HelpURL: \\cern.ch\dfs\Applications\Altium\Datasheets\R0402_Phycomp_RC0402.pdf; Author: CERN DEM JLC; CreateDate: 2007-12-03; LatestRevisionDate: 2012-10-17
R3-R5 R7-R9 R11 R12 R15 R17 R19 R20 R22-R25 R27-R29 R31 = R0402_200R_1%_0.0625W_100PPM: Resistor - 1%; Part Description: General Purpose Thick Film Chip Resistor; Manufacturer: GENERIC; Manufacturer1 Part Number: 232270672001L; TC: ±100ppm/°C; PressFit: No; Part Number: R0402_200R_1%_0.0625W_100PPM; Component Kind: Standard; Component Type: Standard; Pin Count: 2; Value: 200; Status: Not Recommended; Power: 0.0625W; Tolerance: ±1%; Manufacturer Part Number: R0402_200R_1%_0.0625W_100PPM; Case: 0402; Mounted: Yes; Sense: No; Socket: No; SMD: Yes; Manufacturer1 Example: YAGEO PHYCOMP; Manufacturer1 ComponentHeight: 0.4mm; HelpURL: \\cern.ch\dfs\Applications\Altium\Datasheets\R0402_Phycomp_RC0402.pdf; Author: CERN DEM JLC; CreateDate: 03.12.2007; LatestRevisionDate: 17.10.2012
R6 R10 R13 R16 R18 = R0603_1K2_1%_0.1W_100PPM: Resistor - 1%; Part Description: General Purpose Thick Film Chip Resistor; Manufacturer: GENERIC; Manufacturer1 Part Number: NRC06F1201TRF; Power: 0.1W; TC: ±100ppm/°C; Part Number: R0603_1K2_1%_0.1W_100PPM; Component Kind: Standard; Component Type: Standard; Pin Count: 2; Value: 1k2; Status: Preferred; Tolerance: ±1%; Manufacturer Part Number: R0603_1K2_1%_0.1W_100PPM; Case: 0603; Mounted: Yes; Sense: No; Socket: No; SMD: Yes; Manufacturer1 Example: NIC COMPONENT; Manufacturer1 ComponentHeight: 0.55mm; HelpURL: \\cern.ch\dfs\Applications\Altium\Datasheets\R0603_NIC_NRC.pdf; Author: CERN DEM JLC; CreateDate: 03.12.2007; LatestRevisionDate: 13.03.2008
R35 = R0603_12K_1%_0.1W_100PPM: Resistor - 1%; Part Description: General Purpose Thick Film Chip Resistor; Manufacturer: GENERIC; Manufacturer1 Part Number: NRC06F1202TRF; Power: 0.1W; TC: ±100ppm/°C; PressFit: No; Part Number: R0603_12K_1%_0.1W_100PPM; Component Kind: Standard; Component Type: Standard; Pin Count: 2; Value: 12k; Status: Preferred; Tolerance: ±1%; Manufacturer Part Number: R0603_12K_1%_0.1W_100PPM; Case: 0603; Mounted: Yes; Sense: No; Socket: No; SMD: Yes; Manufacturer1 Example: NIC COMPONENT; Manufacturer1 ComponentHeight: 0.55mm; HelpURL: \\cern.ch\dfs\Applications\Altium\Datasheets\R0603_NIC_NRC.pdf; Author: CERN DEM JLC; CreateDate: 03.12.2007; LatestRevisionDate: 13.03.2008
R39 = R0603_3K3_1%_0.1W_100PPM: Resistor - 1%; Part Description: General Purpose Thick Film Chip Resistor; Manufacturer: GENERIC; Manufacturer1 Part Number: NRC06F3301TRF; Power: 0.1W; TC: ±100ppm/°C; PressFit: No; Part Number: R0603_3K3_1%_0.1W_100PPM; Component Kind: Standard; Component Type: Standard; Pin Count: 2; Value: 3k3; Status: Preferred; Tolerance: ±1%; Manufacturer Part Number: R0603_3K3_1%_0.1W_100PPM; Case: 0603; Mounted: Yes; Sense: No; Socket: No; SMD: Yes; Manufacturer1 Example: NIC COMPONENT; Manufacturer1 ComponentHeight: 0.55mm; HelpURL: \\cern.ch\dfs\Applications\Altium\Datasheets\R0603_NIC_NRC.pdf; Author: CERN DEM JLC; CreateDate: 03.12.2007; LatestRevisionDate: 13.03.2008
SW1 = SW_TYCO_1-1437575-4: SPDT Switch; Part Description: 30VDC, 100mA, Slide Low Profile SPDT Switch, SSA Series; Manufacturer: TYCO; Manufacturer Part Number: 1-1437575-4 or SSA-12; PressFit: No; Part Number: SW_TYCO_1-1437575-4; Component Kind: Standard; Component Type: Standard; Pin Count: 3; PackageDescription: Body 8.79 x 3.4mm, Slide Low Profile SPDT Switch, SSA Series; Family: Switch; Mounted: Yes; Socket: No; SMD: No; Sense: No; Status: None; ComponentHeight: 5.4mm; HelpURL: \\cern.ch\dfs\Applications\Altium\Datasheets\SW_TYCO_1-1437575-4.pdf; Author: CERN DEM JLC; CreateDate: 11.11.2013; LatestRevisionDate: 11.11.2013
TP1 TP2 = SMD_PAD_1.27X1.27MM: Part Description: 1.27mm x 1.27mm PCB Copper Area (SMD Test Point); Mounted: No; Part Number: SMD_PAD_1.27X1.27MM; Component Kind: Standard (No BOM); Component Type: Standard (No BOM); Pin Count: 1; Family: Test Point; Socket: No; SMD: Yes; Sense: No; Status: None; ComponentHeight: 0mm; HelpURL: Undefined; Author: CERN DEM JLC; CreateDate: 12.01.2008; LatestRevisionDate: 12.01.2008; PackageDescription: 1.27mm x 1.27mm PCB Copper Area (SMD Test Point)
TR1-TR12 = XFMR_MINI-CIRCUITS_TCM2-43X+: 50 OHMS 10 to 4000 MHz RF Transformer; Power: 0.4W; Part Number: XFMR_MINI-CIRCUITS_TCM2-43X+; Component Kind: Standard; Component Type: Standard; Pin Count: 6; Value: 1:2; Status: None; Part Description: 50 Ohms 10 to 4000MHz RF Transformer; Manufacturer: MINI-CIRCUITS; Manufacturer Part Number: TCM2-43X+; Mounted: Yes; Socket: No; Sense: No; SMD: Yes; ComponentHeight: 4.06mm; HelpURL: \\cern.ch\dfs\Applications\Altium\Datasheets\XFMR_MINI-CIRCUITS_TCM2-43X+.pdf; Author: CERN DEM BC; CreateDate: 2016-02-12; LatestRevisionDate: 2016-02-12